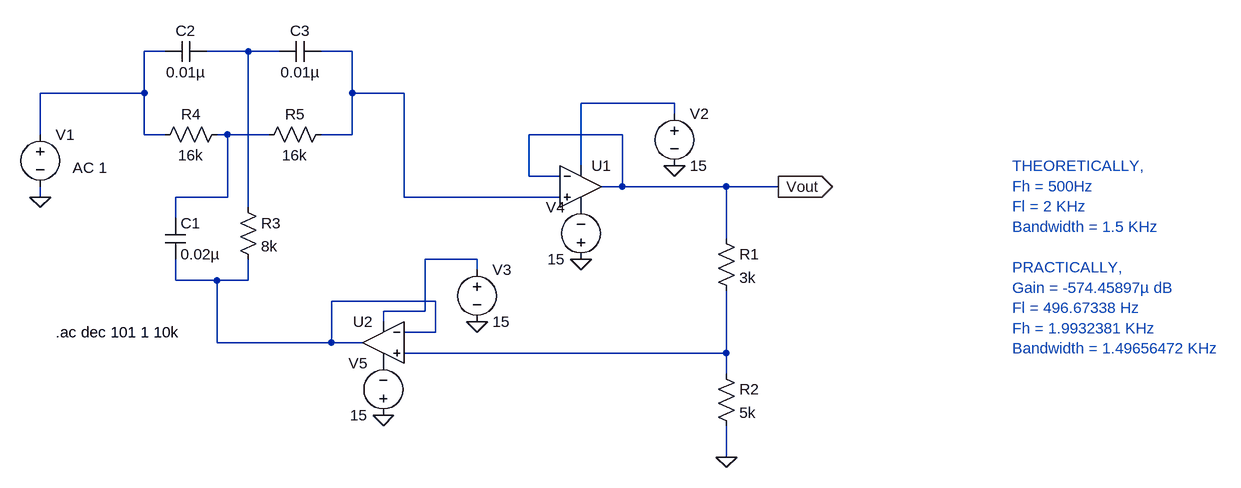
[diagram p0: schematic band_stop_filter.asc]
band_stop_filter.asc, the LTspice schematic file:
Version 4
SHEET 1 1272 680
WIRE -384 -384 -416 -384
WIRE -256 -384 -320 -384
WIRE -208 -384 -256 -384
WIRE -96 -384 -144 -384
WIRE -416 -320 -416 -384
WIRE -416 -320 -576 -320
WIRE -96 -320 -96 -384
WIRE -16 -320 -96 -320
WIRE 400 -304 256 -304
WIRE 400 -288 400 -304
WIRE -576 -256 -576 -320
WIRE -416 -256 -416 -320
WIRE -384 -256 -416 -256
WIRE -288 -256 -304 -256
WIRE -224 -256 -288 -256
WIRE -96 -256 -96 -320
WIRE -96 -256 -144 -256
WIRE 320 -256 176 -256
WIRE 256 -208 256 -304
WIRE 176 -192 176 -256
WIRE 224 -192 176 -192
WIRE 320 -176 320 -256
WIRE 320 -176 288 -176
WIRE 480 -176 320 -176
WIRE 560 -176 480 -176
WIRE -576 -160 -576 -176
WIRE -288 -160 -288 -256
WIRE -288 -160 -368 -160
WIRE -16 -160 -16 -320
WIRE 224 -160 -16 -160
WIRE -256 -144 -256 -384
WIRE -368 -128 -368 -160
WIRE 480 -96 480 -176
WIRE 96 -64 16 -64
WIRE 96 -48 96 -64
WIRE -368 -32 -368 -64
WIRE -304 -32 -368 -32
WIRE -256 -32 -256 -64
WIRE -256 -32 -304 -32
WIRE 32 0 -128 0
WIRE 16 16 16 -64
WIRE 16 16 -48 16
WIRE -48 32 -48 16
WIRE 32 48 32 0
WIRE 32 48 -16 48
WIRE -304 64 -304 -32
WIRE -128 64 -128 0
WIRE -128 64 -304 64
WIRE -80 64 -128 64
WIRE 480 80 480 -16
WIRE 480 80 -16 80
WIRE 480 112 480 80
WIRE 480 240 480 192
FLAG 480 240 0
FLAG -576 -160 0
FLAG -48 176 0
FLAG 256 -64 0
FLAG 96 32 0
FLAG 400 -208 0
FLAG 560 -176 Vout
IOPIN 560 -176 Out
SYMBOL OpAmps\\UniversalOpamp2 256 -176 R0
SYMATTR InstName U1
SYMBOL OpAmps\\UniversalOpamp2 -48 64 M0
SYMATTR InstName U2
SYMBOL res 464 -112 R0
SYMATTR InstName R1
SYMATTR Value 3k
SYMBOL res 464 96 R0
SYMATTR InstName R2
SYMATTR Value 5k
SYMBOL res -272 -160 R0
SYMATTR InstName R3
SYMATTR Value 8k
SYMBOL cap -384 -128 R0
SYMATTR InstName C1
SYMATTR Value 0.02µ
SYMBOL res -288 -272 R90
WINDOW 0 0 56 VBottom 2
WINDOW 3 32 56 VTop 2
SYMATTR InstName R4
SYMATTR Value 16k
SYMBOL res -128 -272 R90
WINDOW 0 0 56 VBottom 2
WINDOW 3 32 56 VTop 2
SYMATTR InstName R5
SYMATTR Value 16k
SYMBOL cap -320 -400 R90
WINDOW 0 0 32 VBottom 2
WINDOW 3 32 32 VTop 2
SYMATTR InstName C2
SYMATTR Value 0.01µ
SYMBOL cap -144 -400 R90
WINDOW 0 0 32 VBottom 2
WINDOW 3 32 32 VTop 2
SYMATTR InstName C3
SYMATTR Value 0.01µ
SYMBOL voltage -576 -272 R0
WINDOW 123 50 67 Left 2
WINDOW 39 0 0 Left 0
SYMATTR Value2 AC 1
SYMATTR InstName V1
SYMATTR Value ""
SYMBOL voltage 400 -304 R0
WINDOW 123 0 0 Left 0
WINDOW 39 0 0 Left 0
SYMATTR InstName V2
SYMATTR Value 15
SYMBOL voltage 96 -64 R0
WINDOW 123 0 0 Left 0
WINDOW 39 0 0 Left 0
SYMATTR InstName V3
SYMATTR Value 15
SYMBOL voltage 256 -48 R180
WINDOW 0 24 96 Left 2
WINDOW 3 24 16 Left 2
WINDOW 123 0 0 Left 0
WINDOW 39 0 0 Left 0
SYMATTR InstName V4
SYMATTR Value 15
SYMBOL voltage -48 192 R180
WINDOW 0 24 96 Left 2
WINDOW 3 24 16 Left 2
WINDOW 123 0 0 Left 0
WINDOW 39 0 0 Left 0
SYMATTR InstName V5
SYMATTR Value 15
TEXT -552 48 Left 2 !.ac dec 101 1 10k
TEXT 920 -208 Left 2 ;THEORETICALLY,\nFh = 500Hz\nFl = 2 KHz\nBandwidth = 1.5 KHz\n \nPRACTICALLY,\nGain = -574.45897µ dB\nFl = 496.67338 Hz\nFh = 1.9932381 KHz\nBandwidth = 1.49656472 KHz

The netlist it stands for:
* band_stop_filter.asc
XU1 N003 Vout N004 P001 Vout level.2 Avol=1Meg GBW=10Meg Slew=10Meg ilimit=25m rail=0 Vos=0 phimargin=45 en=0 enk=0 in=0 ink=0 Rin=500Meg  ; pins IN+ IN- V+ V- OUT
XU2 N008 N007 N006 P002 N007 level.2 Avol=1Meg GBW=10Meg Slew=10Meg ilimit=25m rail=0 Vos=0 phimargin=45 en=0 enk=0 in=0 ink=0 Rin=500Meg  ; pins IN+ IN- V+ V- OUT
R1 Vout N008 3k
R2 N008 0 5k
R3 N002 N007 8k
C1 N005 N007 0.02µ
R4 N005 N001 16k
R5 N003 N005 16k
C2 N002 N001 0.01µ
C3 N003 N002 0.01µ
V1 N001 0 AC 1
V2 N004 0 15
V3 N006 0 15
V4 0 P001 15
V5 0 P002 15
.ac dec 101 1 10k
* THEORETICALLY,
* Fh = 500Hz
* Fl = 2 KHz
* Bandwidth = 1.5 KHz
* PRACTICALLY,
* Gain = -574.45897µ dB
* Fl = 496.67338 Hz
* Fh = 1.9932381 KHz
* Bandwidth = 1.49656472 KHz
.lib UniversalOpamps2.sub
.backanno
.end